# EAGLE design controller (EAGLE 6.6.0)
DESIGNER: jakob voigts; DESIGN_NAME: reward port; REVISION: 0.1
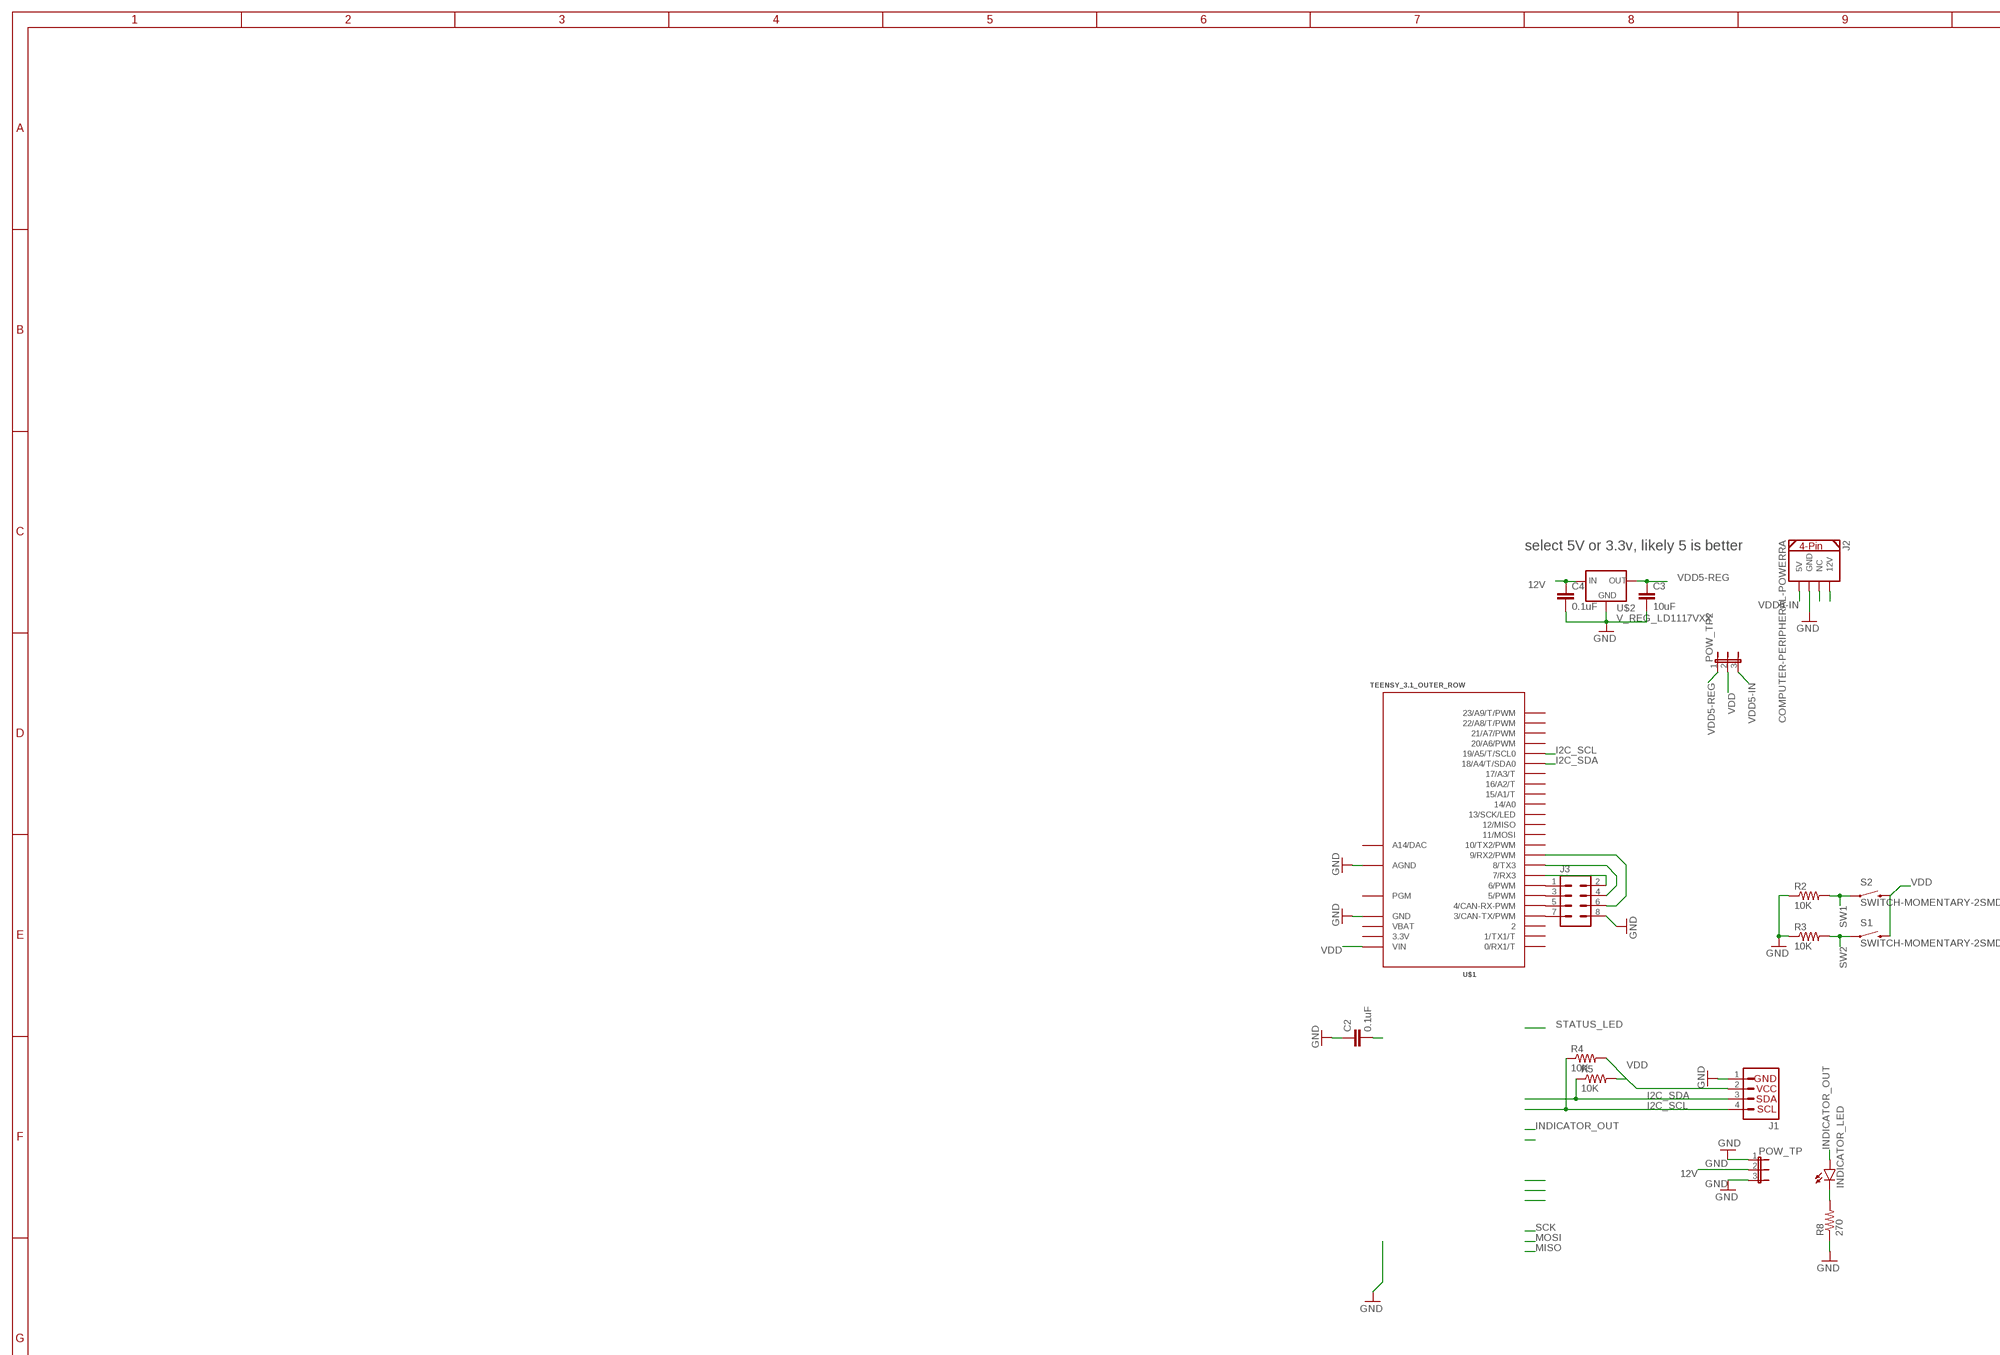
[diagram p0: schematic, sheet 1, part 1 of 3]
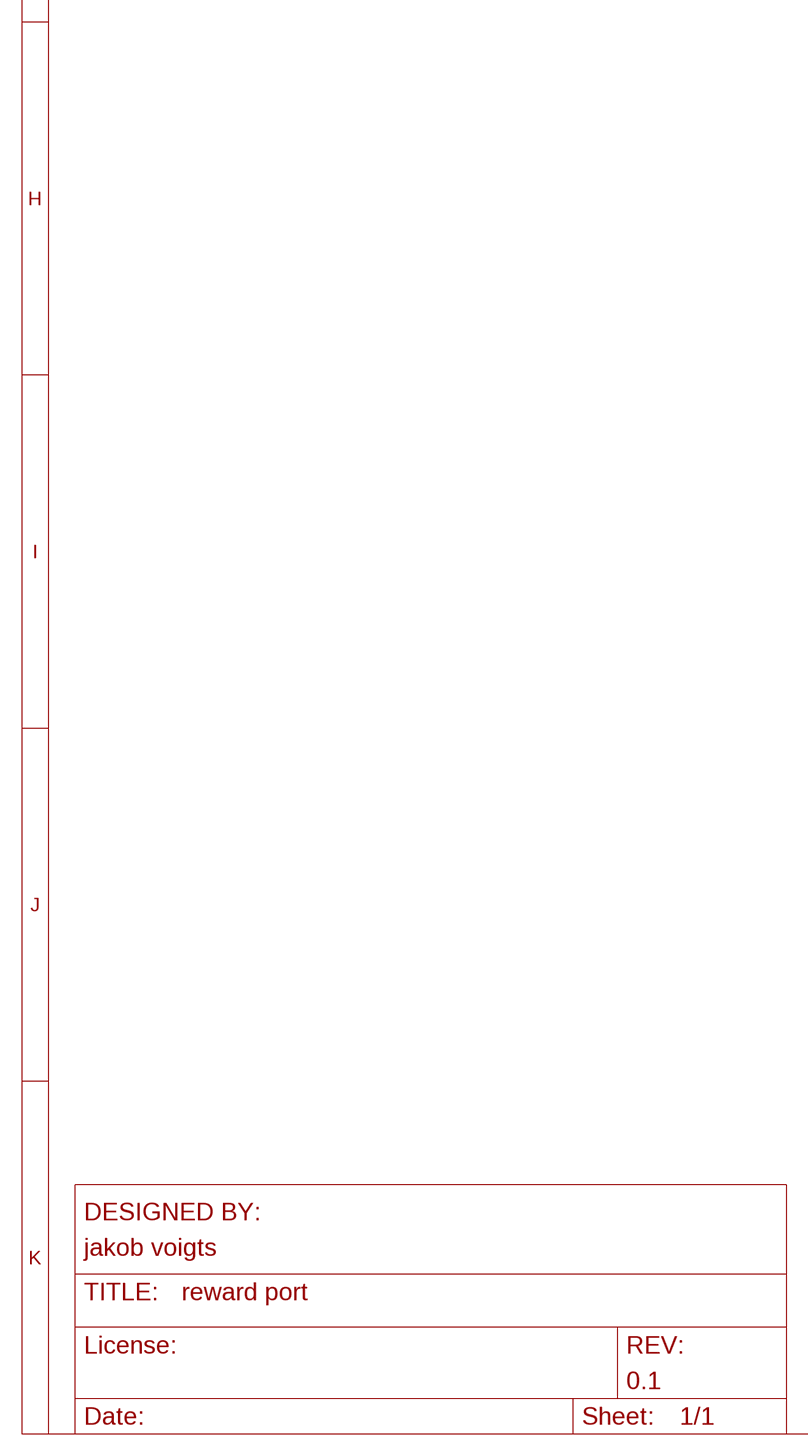
[diagram p1: schematic, sheet 1, part 2 of 3]
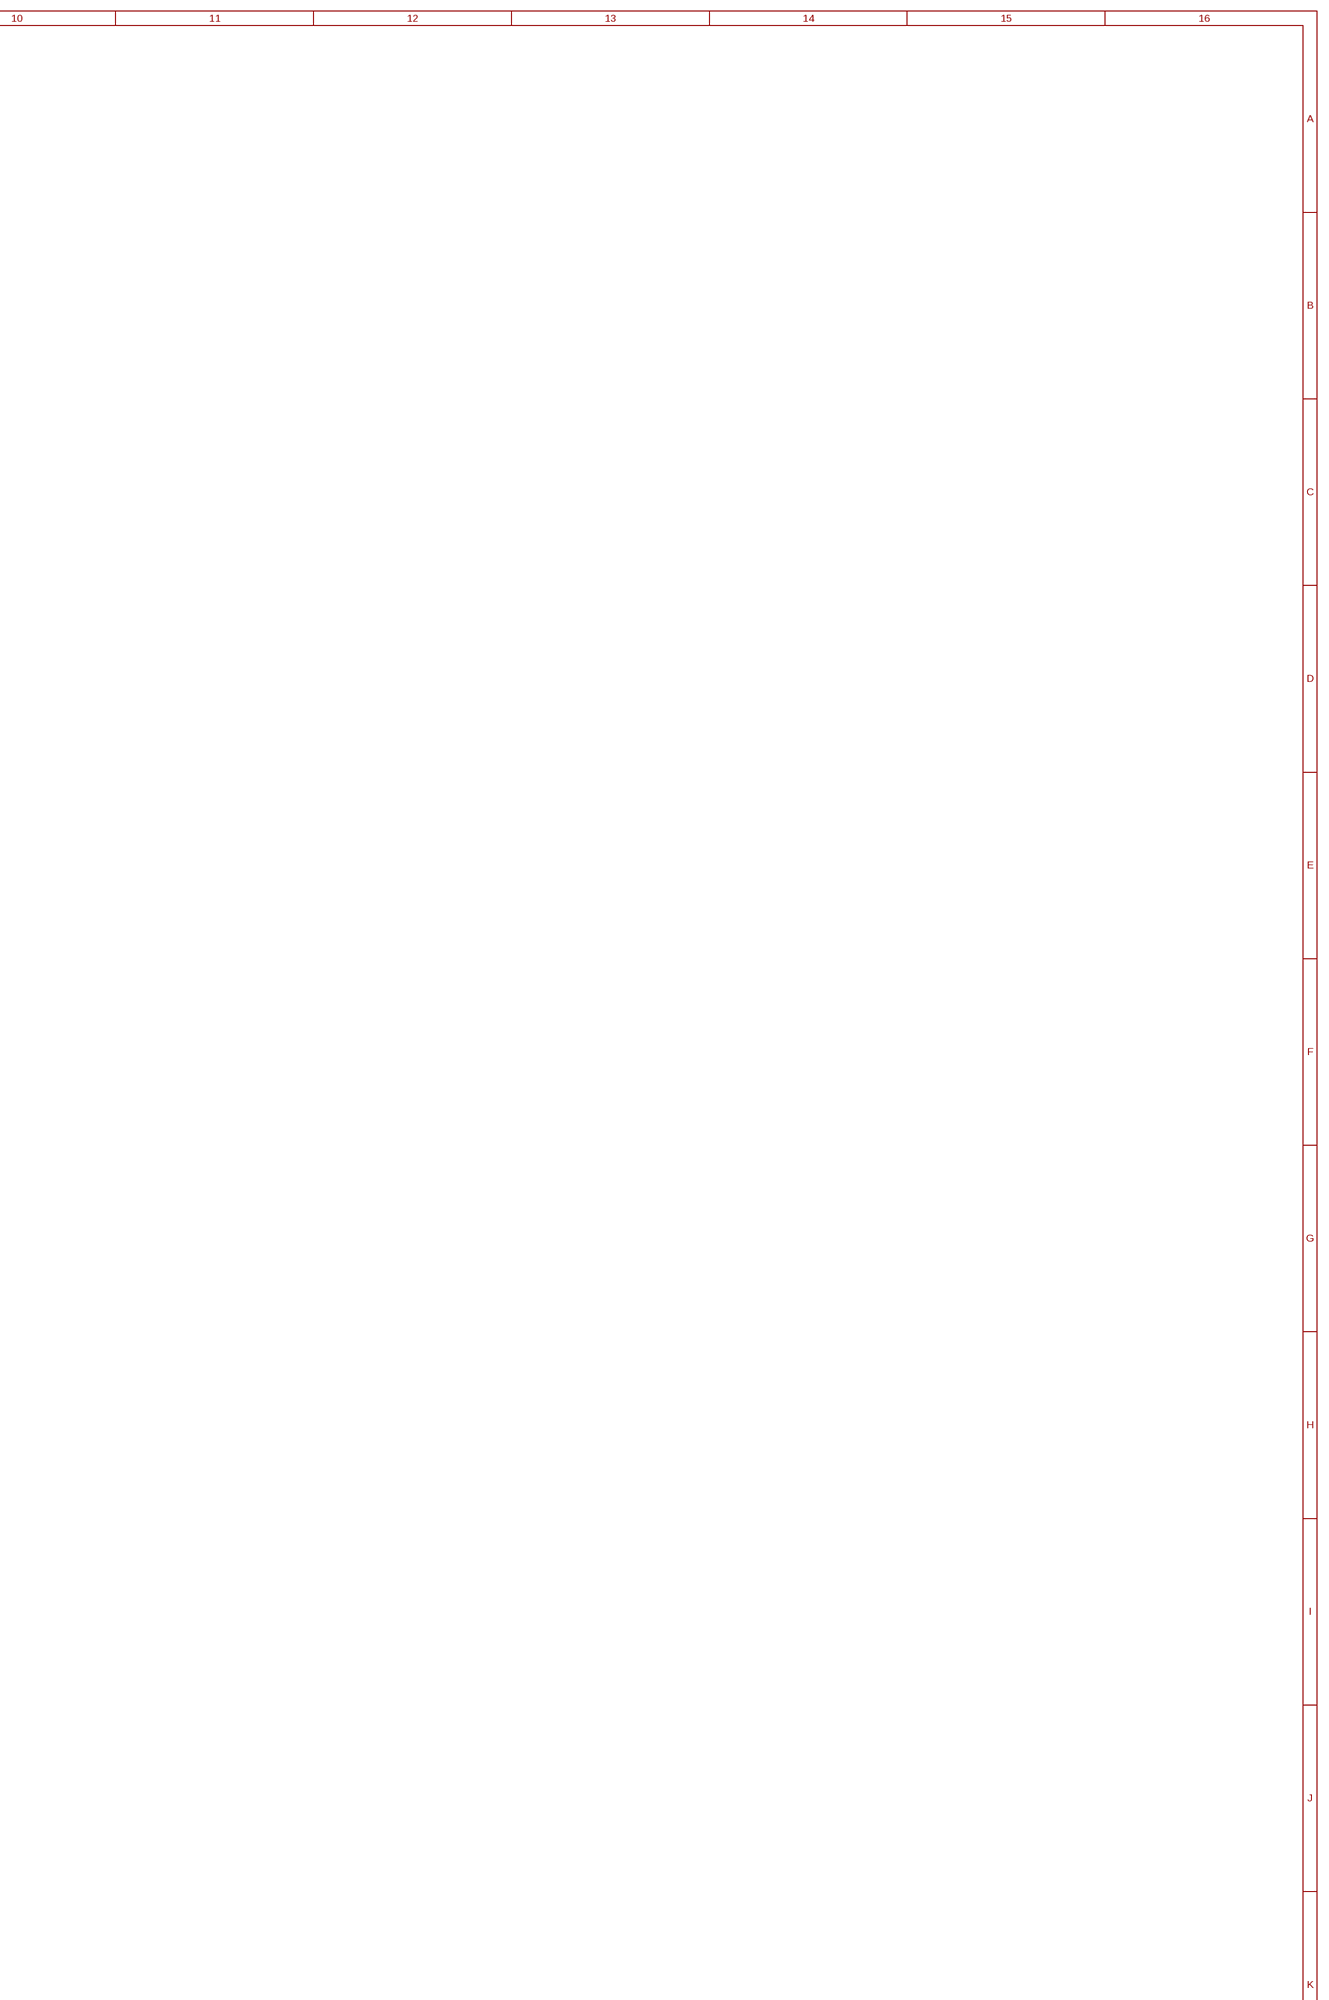
[diagram p2: schematic, sheet 1, part 3 of 3]

## Parts
C2  0.1uF  0.1UF-25V(+80/-20%)(0603)  [0603-CAP]
C3  10uF  10UF-6.3V-20%(0603)  [0603-CAP]
C4  0.1uF  0.1UF-25V-5%(0603)  [0603-CAP]
INDICATOR_LED  LED-3MM-NO_SILK  [LED3MM-NS]
J1  I2C_STANDARD  [1X04]
J2  COMPUTER-PERIPHERAL-POWERRA  [COMPUTER-PERIPHERAL-POWER-RA]
J3  M04X2  [2X4]
POW_TP  JP3E  [JP3]
POW_TP2  JP3E  [JP3]
R2  10K  10KOHM-1/10W-1%(0603)0603  [0603-RES]
R3  10K  10KOHM-1/10W-1%(0603)0603  [0603-RES]
R4  10K  10KOHM-1/10W-1%(0603)0603  [0603-RES]
R5  10K  10KOHM-1/10W-1%(0603)0603  [0603-RES]
R8  270  10KOHM-1/10W-1%(0603)0603  [0603-RES]
S1  SWITCH-MOMENTARY-2SMD-4  [TACTILE_SWITCH_TALL]
S2  SWITCH-MOMENTARY-2SMD-4  [TACTILE_SWITCH_TALL]
U$1  TEENSY_3.1_OUTER_ROW  [TEENSY3-OUTER_ROW]
U$2  V_REG_LD1117VXX  [78XXL]

## Nets
12V: C4.1 POW_TP.2 U$2.OUT(IN)
GND: C2.1 C3.2 C4.2 J1.1 J2.GND J3.8 POW_TP.1 POW_TP.3 R2.1 R3.1 R8.1 U$1.AGND U$1.GND U$1.GND1(GND) U$2.IN(GND)
I2C_SCL: J1.4 R4.1 U$1.19/A5(19/A5/T/SCL0)
I2C_SDA: J1.3 R5.1 U$1.18/A4(18/A4/T/SDA0)
INDICATOR_OUT: INDICATOR_LED.A
N$3: J2.12V
N$6: J3.1 U$1.6(6/PWM)
N$7: J2.NC
N$8: J3.3 U$1.5(5/PWM)
N$9: J3.5 U$1.4(4/CAN-RX-PWM)
N$11: J3.7 U$1.3(3/CAN-TX/PWM)
N$12: J3.2 U$1.7(7/RX3)
N$13: J3.4 U$1.8(8/TX3)
N$15: C2.2
N$16: INDICATOR_LED.K(C) R8.2
N$17: J3.6 U$1.9(9/RX2/PWM)
SW1: R2.2 S2.A2
SW2: R3.2 S1.A2
VDD: J1.2 POW_TP2.2 R4.2 R5.2 S1.B2 S2.B2 U$1.VIN
VDD5-IN: J2.5V POW_TP2.3
VDD5-REG: C3.1 POW_TP2.1 U$2.GND(OUT)
Unconnected: U$1.0(0/RX1/T) U$1.1(1/TX1/T) U$1.2 U$1.10(10/TX2/PWM) U$1.11(11/MOSI) U$1.12(12/MISO) U$1.13(13/SCK/LED) U$1.14/A0 U$1.15/A1(15/A1/T) U$1.16/A2(16/A2/T) U$1.17/A3(17/A3/T) U$1.20/A6(20/A6/PWM) U$1.21/A7(21/A7/PWM) U$1.22/A8(22/A8/T/PWM) U$1.23/A9(23/A9/T/PWM) U$1.PGM U$1.RESET/DAC(A14/DAC)

## Notes on the sheet
- select 5V or 3.3v, likely 5 is better

## Power pins joined to a net without a drawn wire
3.3V: U$1.3.3V U$1.3.3V1(3.3V)
VBAT: U$1.VBAT

## Library data of the parts
C2 = SparkFun-Capacitors:0.1UF-25V(+80/-20%)(0603): CAP-00810 Ceramic Standard decoupling cap; PROD_ID: CAP-00810
C3 = SparkFun-Capacitors:10UF-6.3V-20%(0603): CAP-11015; PROD_ID: CAP-11015
C4 = SparkFun-Capacitors:0.1UF-25V-5%(0603): CAP-08604; PROD_ID: CAP-08604
INDICATOR_LED = SparkFun-LED:LED: LEDs Standard schematic elements and footprints for 5mm, 3mm, 1206, and 0603 sized LEDs. 5mm - Spark Fun Electronics SKU : COM-00529 (and others)
J1 = SparkFun-Connectors:I2C_STANDARD: SparkFun has standardized on a pinout for all I2C based sensor breakouts. This pinout allows I2C boards to be plugged directly into the headers on Arduino Uno compatible boards, and to be daisy chained easily.
J2 = SparkFun-Connectors:COMPUTER-PERIPHERAL-POWER
J3 = SparkFun-Connectors:M04X2: .1" header, two rows of four.
POW_TP POW_TP2 = jonnew:JP3E
R2-R5 = SparkFun-Resistors:10KOHM-1/10W-1%(0603): RES-00824; PROD_ID: RES-00824
R8 = SparkFun-Resistors:10KOHM-1/10W-1%(0603): RES-00824; PROD_ID: RES-00824; VALUE: 10K
S1 S2 = SparkFun-Electromechanical:SWITCH-MOMENTARY-2: Various NO switches- pushbuttons, reed, etc; PROD_ID: SWCH-11966
U$1 = Teensy_3_and_LC_Series_Boards_v1.1:TEENSY_3.1_OUTER_ROW: Footprint for Teensy 3.1 or 3.2 board using all pin connections on the outer perimeter
U$2 = SparkFun-PowerIC:V_REG_LD1117VXX: LD1117VXX voltage regulator. We carry the 3.3V version (COM-00526) in TO-220 package.

## Board
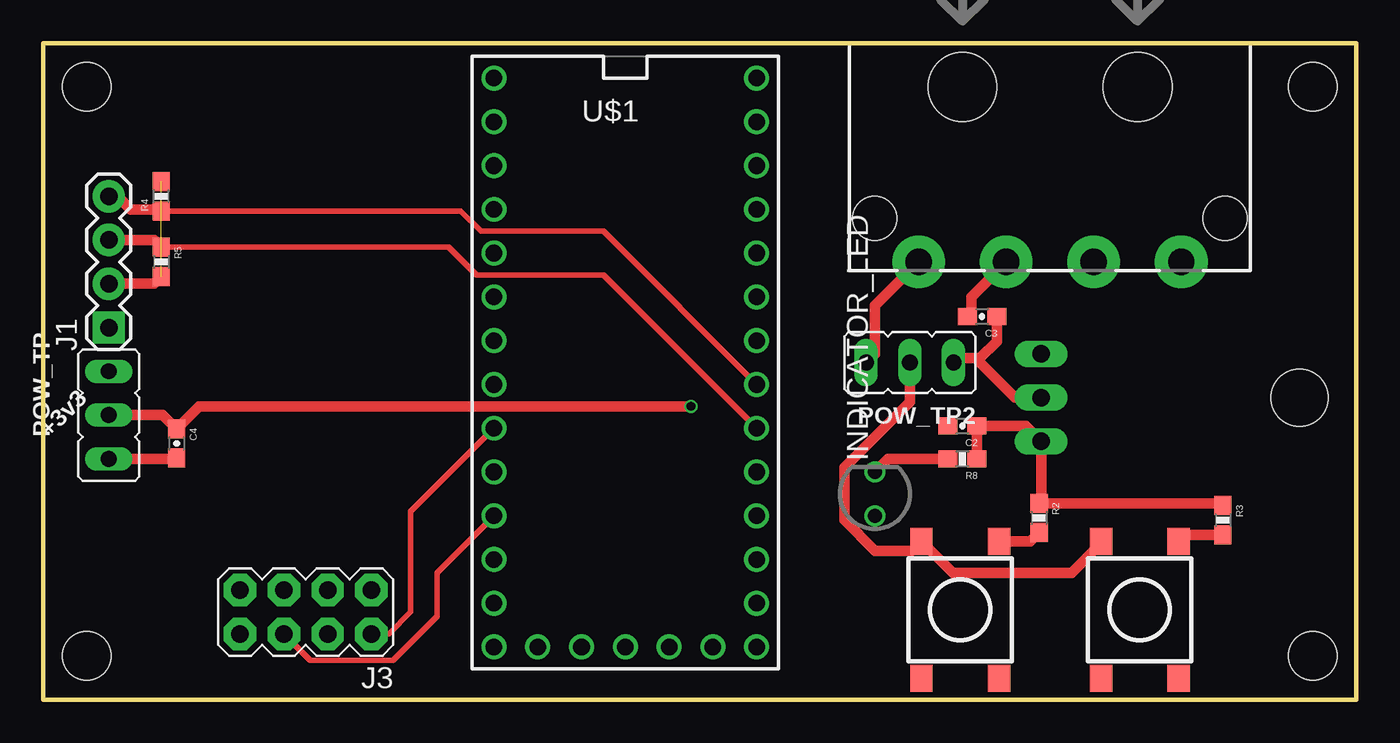
[diagram p3: board, top side]
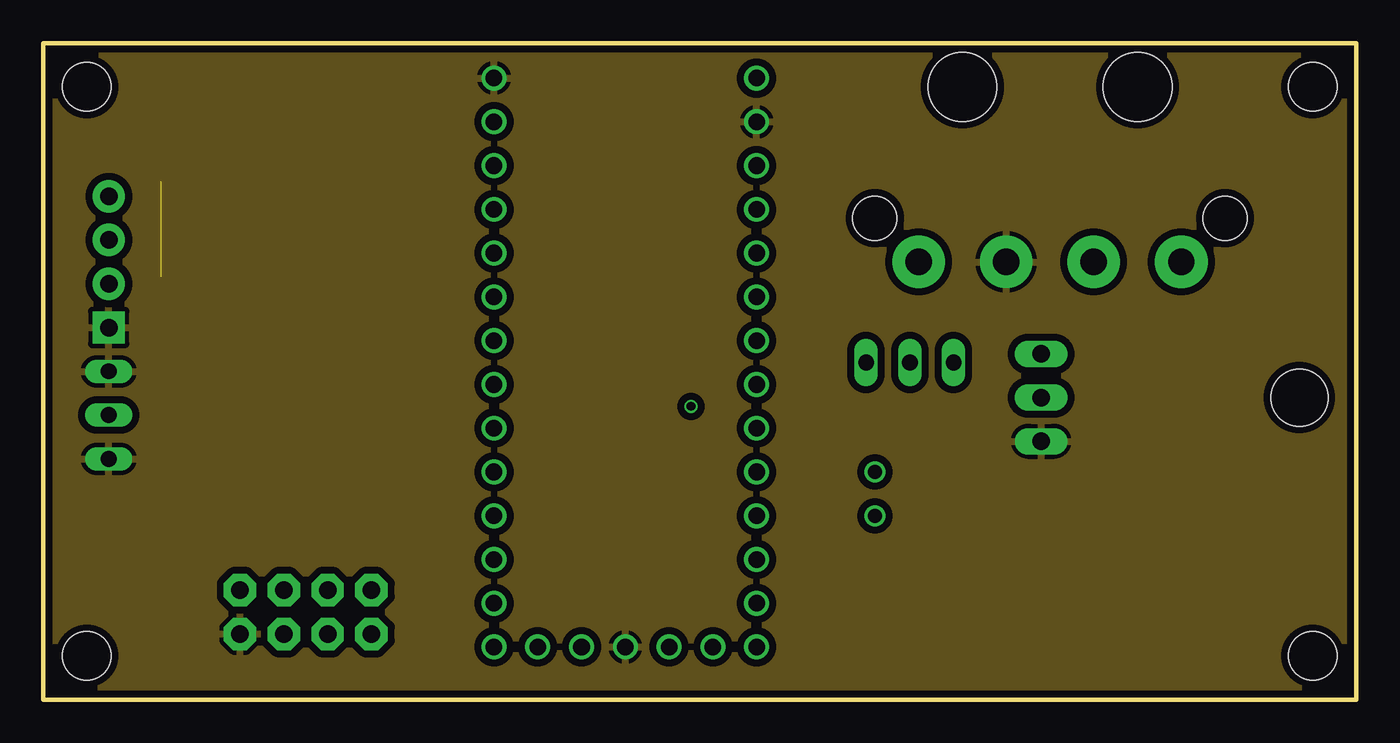
[diagram p4: board, inner layer $GND]
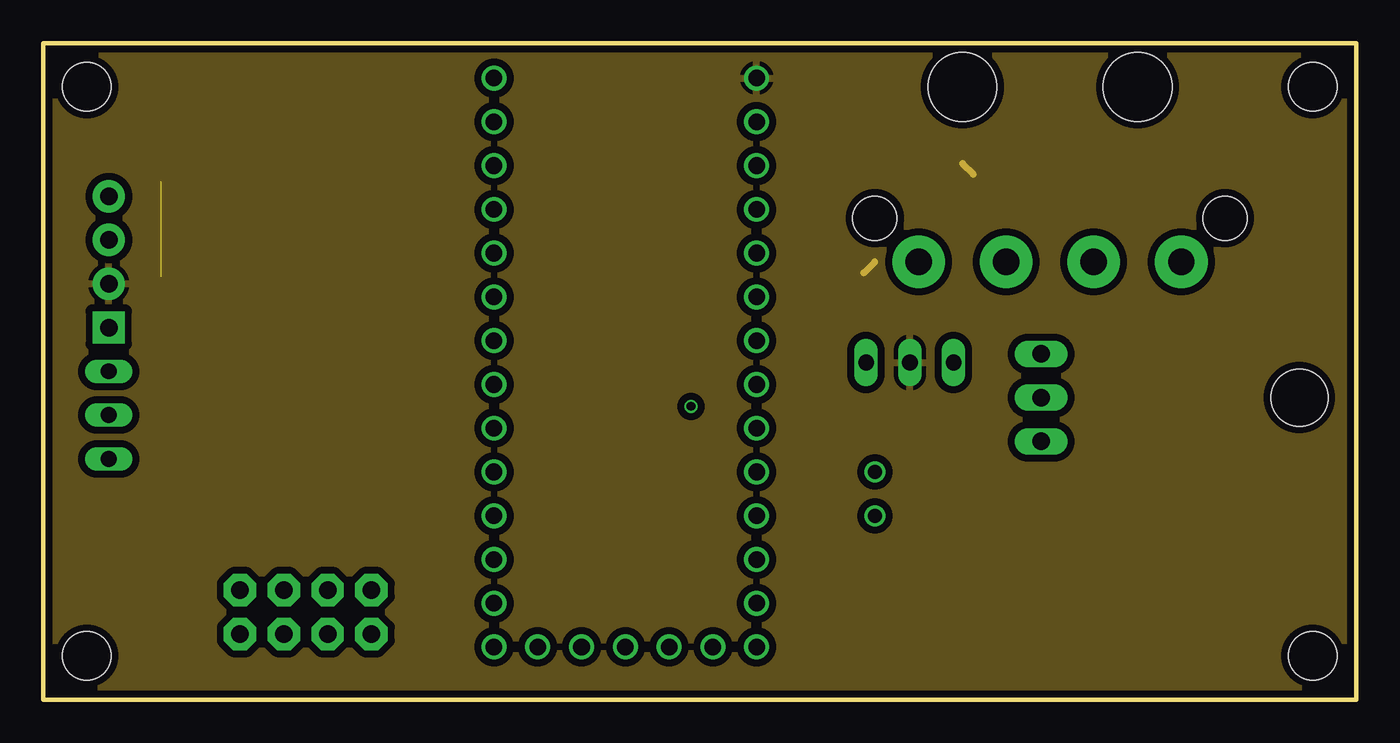
[diagram p5: board, inner layer $VCC]
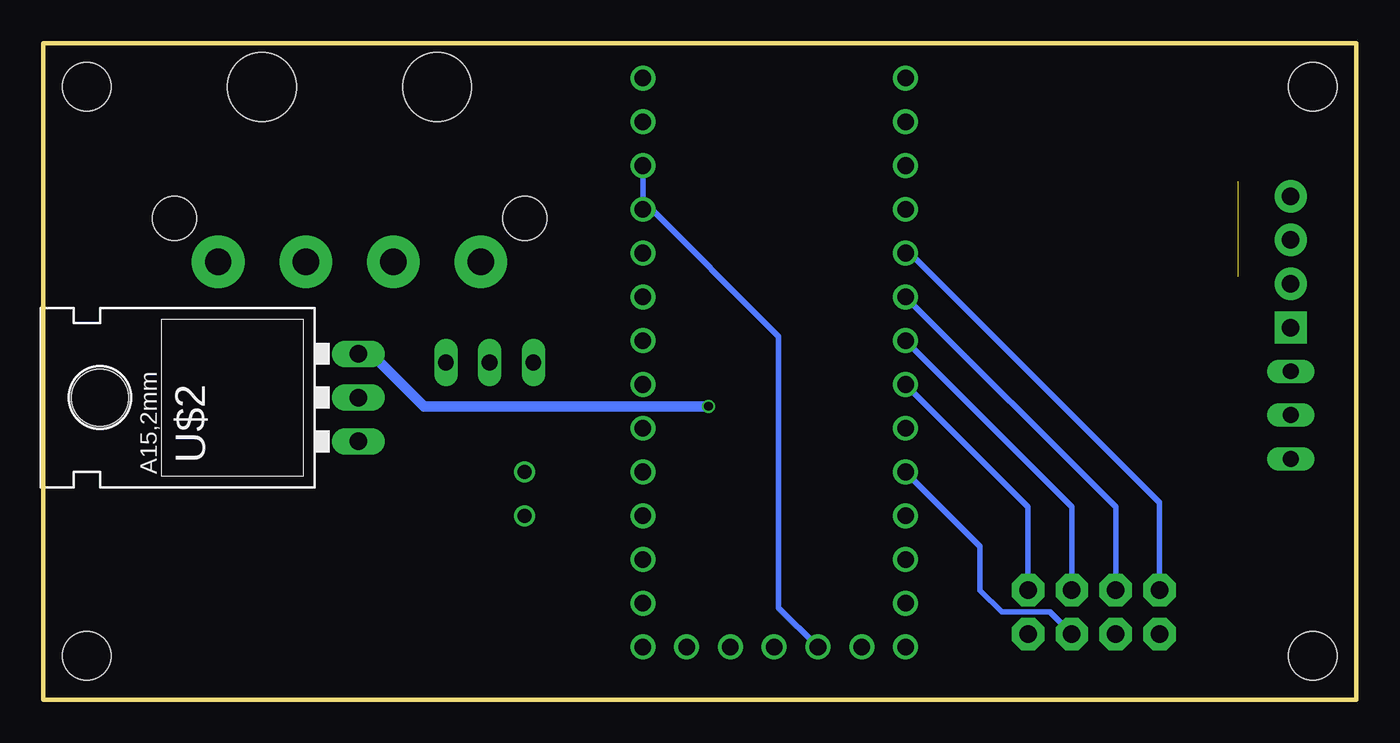
[diagram p6: board, bottom side, seen from below]

Size 76.2 x 38.1 mm. Coordinates in mm from the lower left corner, seen from the top.
Outline: 0,0 76.2,0 76.2,38.1 0,38.1 0,0
Copper layers (1*2*15*16): Top 0.035mm / dielectric 0.2mm / $GND 0.0175mm / dielectric 0.3mm / $VCC 0.0175mm / dielectric 0.2mm / Bottom 0.035mm
Design rules "seeed-studio-4-layer": minimum track width 8mil, minimum drill 12mil, track to track 8mil, track to pad 8mil, pad to pad 8mil, via to via 8mil, smd to smd 0mil, copper to edge 10mil, drill to drill 8mil, minimum pad ring 6mil, minimum via ring 4mil, stop-mask expansion 4mil, vias tented up to drill 100mil, thermal gap 10mil
Holes 2.8 mm at 73.66,35.56 2.54,35.56 2.54,2.54 73.66,2.54

### Footprints (pad centres in the part's own frame; a part is rotated, then mirrored left to right if it is on the bottom)
0603-CAP = smd 1.1 x 1: 1 -0.85,0; 2 0.85,0
LED3MM-NS = drill 0.813: A -1.27,0; K 1.27,0
1X04 = drill 1.016 pad 1.88 square: 1 0,0 | drill 1.016 pad 1.88: 2 2.54,0; 3 5.08,0; 4 7.62,0
COMPUTER-PERIPHERAL-POWER-RA = drill 1.524 pad 3.048: 5V -7.62,-2.54; 12V 7.62,-2.54; GND -2.54,-2.54; NC 2.54,-2.54 | hole 2.54: -10.16,0; 10.16,0 | hole 3.988: -5.08,7.62; 5.08,7.62
2X4 = drill 1.016 pad 1.88 octagon: 1 -3.81,-1.27; 2 -3.81,1.27; 3 -1.27,-1.27; 4 -1.27,1.27; 5 1.27,-1.27; 6 1.27,1.27; 7 3.81,-1.27; 8 3.81,1.27
JP3 = drill 0.914 long: 1 0,0; 2 2.54,0; 3 5.08,0
0603-RES = smd 1.1 x 1: 1 -0.85,0; 2 0.85,0
TACTILE_SWITCH_TALL = smd 1.55 x 1.3: A1 -3.975,-2.25; A2 3.975,-2.25; B1 -3.975,2.25; B2 3.975,2.25
TEENSY3-OUTER_ROW = drill 0.965: 0 -7.62,13.97; 1 -7.62,11.43; 2 -7.62,8.89; 3 -7.62,6.35; 3.3V 7.62,11.43; 3.3V1 -2.54,-16.51; 4 -7.62,3.81; 5 -7.62,1.27; 6 -7.62,-1.27; 7 -7.62,-3.81; 8 -7.62,-6.35; 9 -7.62,-8.89; 10 -7.62,-11.43; 11 -7.62,-13.97; 12 -7.62,-16.51; 13 7.62,-16.51; 14/A0 7.62,-13.97; 15/A1 7.62,-11.43; 16/A2 7.62,-8.89; 17/A3 7.62,-6.35; 18/A4 7.62,-3.81; 19/A5 7.62,-1.27; 20/A6 7.62,1.27; 21/A7 7.62,3.81; 22/A8 7.62,6.35; 23/A9 7.62,8.89; AGND 7.62,13.97; GND -7.62,16.51; GND1 0,-16.51; PGM 2.54,-16.51; RESET/DAC 5.08,-16.51; VBAT -5.08,-16.51; VIN 7.62,16.51
78XXL = drill 1.016 long: GND 0,-3.81; IN -2.54,-3.81; OUT 2.54,-3.81 | hole 3.302: 0,11.176

### Placement (x,y rotation side)
C2  53.34,15.87 180 top
C3  54.48,22.23 180 top
C4  7.75,14.86 270 top
INDICATOR_LED  48.26,11.94 90 top
J1  3.81,21.59 90 top
J2  58.42,27.94 0 top
J3  15.24,5.08 180 top
POW_TP  3.81,19.05 270 top
POW_TP2  52.83,19.56 180 top
R2  57.79,10.54 270 top
R3  68.45,10.41 270 top
R4  6.86,29.21 90 top
R5  6.86,25.4 270 top
R8  53.34,13.97 180 top
S1  63.63,5.21 90 top
S2  53.21,5.21 90 top
U$1  33.78,19.56 0 top
U$2  61.72,17.53 90 bottom

### Tracks (layer width: path | path; a pad name or v marks a point on that pad's centre or on a via)
3.3V
  Bottom 0.305: U$1.3.3V 41.4,28.96 33.53,21.08 33.53,5.33 U$1.3.3V1
12V  (via drill 0.5)
  Top 0.61: POW_TP.2 6.95,16.51 C4.1 9.06,17.02 v37.59,17.02
  Bottom 0.61: U$2.OUT 57.15,20.07 54.1,17.02 v37.59,17.02
GND
  Top 0.61: POW_TP.3 7.71,13.97 C4.2 | J2.GND 53.85,23.37 53.85,22.44 C3.2 | R8.1 C2.1 57.02,15.87 U$2.IN 57.91,11.52 R2.1 68.33,11.39 R3.1
  pour $GND (isolate 0.406): -9.91,39.12 -9.91,-30.1 89.28,-30.61 89.28,38.61
I2C_SCL
  Top 0.305: R4.1 24.22,28.36 25.4,27.18 32.51,27.18 U$1.19/A5
  Top 0.61: J1.4 4.32,29.21 5.08,28.45 6.77,28.45 R4.1
I2C_SDA
  Top 0.305: R5.1 23.53,26.25 25.15,24.64 32.51,24.64 U$1.18/A4
  Top 0.61: J1.3 6.44,26.67 R5.1
N$6
  Bottom 0.305: U$1.6 19.05,11.18 J3.1
N$8
  Bottom 0.305: U$1.5 16.51,11.18 J3.3
N$9
  Bottom 0.305: U$1.4 13.97,11.18 J3.5
N$11
  Bottom 0.305: U$1.3 25.91,25.91 11.43,11.43 J3.7
N$12
  Top 0.305: U$1.7 21.34,10.92 21.34,5.08 20.07,3.81 J3.2
N$13
  Bottom 0.305: J3.4 17.78,5.08 20.57,5.08 21.84,6.35 21.84,8.89 U$1.8
N$16
  Top 0.61: R8.2 49.02,13.97 INDICATOR_LED.K
N$17
  Top 0.305: U$1.9 22.86,7.37 22.86,4.83 20.32,2.29 15.49,2.29 J3.6
SW1
  Top 0.61: S2.A2 57.28,9.18 R2.2
SW2
  Top 0.61: R3.2 66.26,9.56 S1.A2
VDD  (1 unrouted)
  Top 0.61: J1.2 6.44,24.13 R5.2 | POW_TP2.2 50.29,17.27 46.48,13.46 46.48,10.41 48.26,8.64 50.42,8.64 S2.B2 52.78,7.37 59.69,7.37 61.38,9.05 S1.B2
  $VCC 0.406: 53.34,31.11 53.98,30.48 | 47.62,24.77 48.26,25.4
  pour $VCC (isolate 0.406): 84.84,41.91 15.88,38.1 -12.7,39.5 -12.7,-24.64 84.84,-26.67
VDD5-IN
  Top 0.61: J2.5V 48.26,22.86 48.26,20.07 POW_TP2.3
VDD5-REG
  Top 0.61: C3.1 55.33,20.79 54.36,19.81 54.1,19.81 | 54.1,19.81 53.34,19.81 52.83,19.3 | POW_TP2.1 52.83,19.3 | 52.83,19.3 52.58,19.05 | U$2.GND 56.39,17.53 54.1,19.81

### Text on the board
tPlace: +3v3